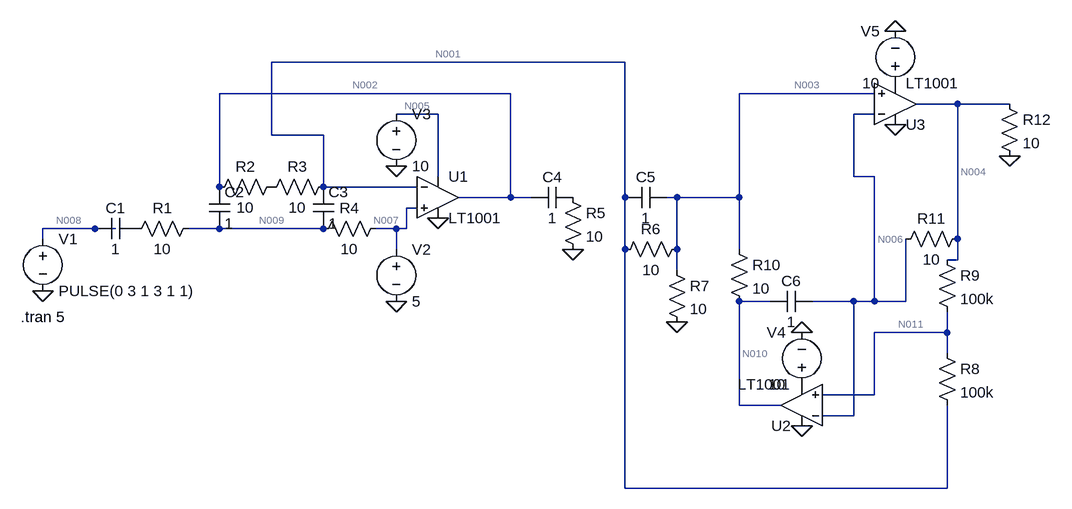
[diagram p0: schematic Draft1.asc]
Draft1.asc, the LTspice schematic file:
Version 4
SHEET 1 880 680
WIRE -336 -240 -880 -240
WIRE -512 -192 -960 -192
WIRE 48 -192 -160 -192
WIRE 176 -176 112 -176
WIRE 256 -176 176 -176
WIRE -624 -160 -688 -160
WIRE 48 -160 16 -160
WIRE -880 -128 -880 -240
WIRE -800 -128 -880 -128
WIRE -624 -64 -624 -160
WIRE 16 -64 16 -160
WIRE 48 -64 16 -64
WIRE -960 -48 -960 -192
WIRE -800 -48 -800 -128
WIRE -656 -48 -800 -48
WIRE -512 -32 -512 -192
WIRE -512 -32 -592 -32
WIRE -480 -32 -512 -32
WIRE -336 -32 -336 -240
WIRE -256 -32 -272 -32
WIRE -160 -32 -160 -192
WIRE -160 -32 -256 -32
WIRE -656 -16 -672 -16
WIRE -1152 16 -1232 16
WIRE -1120 16 -1152 16
WIRE -960 16 -1008 16
WIRE -800 16 -960 16
WIRE -688 16 -720 16
WIRE -672 16 -672 -16
WIRE -672 16 -688 16
WIRE -1232 32 -1232 16
WIRE 176 32 176 -176
WIRE -688 48 -688 16
WIRE -336 48 -336 -32
WIRE -256 48 -256 -32
WIRE -160 48 -160 -32
WIRE 176 64 176 32
WIRE 176 64 160 64
WIRE -256 80 -256 48
WIRE -112 128 -160 128
WIRE 16 128 -48 128
WIRE 48 128 48 -64
WIRE 48 128 16 128
WIRE 96 128 96 32
WIRE 96 128 48 128
WIRE 160 176 160 144
WIRE 160 176 48 176
WIRE 160 208 160 176
WIRE 48 272 48 176
WIRE 48 272 -32 272
WIRE -160 288 -160 128
WIRE -96 288 -160 288
WIRE 16 304 16 128
WIRE 16 304 -32 304
WIRE -336 416 -336 48
WIRE 160 416 160 288
WIRE 160 416 -336 416
FLAG -1232 112 0
FLAG -688 128 0
FLAG -624 0 0
FLAG -688 -80 0
FLAG -416 48 0
FLAG -256 160 0
FLAG -64 320 0
FLAG -64 176 0
FLAG 80 -144 0
FLAG 80 -288 0
FLAG 256 -96 0
SYMBOL voltage -1232 16 R0
WINDOW 123 0 0 Left 2
WINDOW 39 0 0 Left 2
SYMATTR InstName V1
SYMATTR Value PULSE(0 3 1 3 1 1)
SYMBOL cap -1088 0 R90
WINDOW 0 0 32 VBottom 2
WINDOW 3 32 32 VTop 2
SYMATTR InstName C1
SYMATTR Value 1
SYMBOL res -992 0 R90
WINDOW 0 0 56 VBottom 2
WINDOW 3 32 56 VTop 2
SYMATTR InstName R1
SYMATTR Value 10
SYMBOL cap -976 -48 R0
SYMATTR InstName C2
SYMATTR Value 1
SYMBOL res -864 -64 R90
WINDOW 0 0 56 VBottom 2
WINDOW 3 32 56 VTop 2
SYMATTR InstName R2
SYMATTR Value 10
SYMBOL res -784 -64 R90
WINDOW 0 0 56 VBottom 2
WINDOW 3 32 56 VTop 2
SYMATTR InstName R3
SYMATTR Value 10
SYMBOL cap -816 -48 R0
SYMATTR InstName C3
SYMATTR Value 1
SYMBOL res -704 0 R90
WINDOW 0 0 56 VBottom 2
WINDOW 3 32 56 VTop 2
SYMATTR InstName R4
SYMATTR Value 10
SYMBOL voltage -688 32 R0
WINDOW 123 0 0 Left 2
WINDOW 39 0 0 Left 2
SYMATTR InstName V2
SYMATTR Value 5
SYMBOL Opamps\\LT1001 -624 -96 R0
SYMATTR InstName U1
SYMBOL voltage -688 -176 R0
WINDOW 123 0 0 Left 2
WINDOW 39 0 0 Left 2
SYMATTR InstName V3
SYMATTR Value 10
SYMBOL cap -416 -48 R90
WINDOW 0 0 32 VBottom 2
WINDOW 3 32 32 VTop 2
SYMATTR InstName C4
SYMATTR Value 1
SYMBOL res -432 -48 R0
SYMATTR InstName R5
SYMATTR Value 10
SYMBOL cap -272 -48 R90
WINDOW 0 0 32 VBottom 2
WINDOW 3 32 32 VTop 2
SYMATTR InstName C5
SYMATTR Value 1
SYMBOL res -240 32 R90
WINDOW 0 0 56 VBottom 2
WINDOW 3 32 56 VTop 2
SYMATTR InstName R6
SYMATTR Value 10
SYMBOL res -272 64 R0
SYMATTR InstName R7
SYMATTR Value 10
SYMBOL res 144 192 R0
SYMATTR InstName R8
SYMATTR Value 100k
SYMBOL res 144 48 R0
SYMATTR InstName R9
SYMATTR Value 100k
SYMBOL res -176 32 R0
SYMATTR InstName R10
SYMATTR Value 10
SYMBOL cap -48 112 R90
WINDOW 0 0 32 VBottom 2
WINDOW 3 32 32 VTop 2
SYMATTR InstName C6
SYMATTR Value 1
SYMBOL Opamps\\LT1001 -64 352 R180
SYMATTR InstName U2
SYMBOL voltage -64 272 R180
WINDOW 0 24 96 Left 2
WINDOW 3 24 16 Left 2
WINDOW 123 0 0 Left 2
WINDOW 39 0 0 Left 2
SYMATTR InstName V4
SYMATTR Value 10
SYMBOL res 192 16 R90
WINDOW 0 0 56 VBottom 2
WINDOW 3 32 56 VTop 2
SYMATTR InstName R11
SYMATTR Value 10
SYMBOL Opamps\\LT1001 80 -112 M180
SYMATTR InstName U3
SYMBOL voltage 80 -192 R180
WINDOW 0 24 96 Left 2
WINDOW 3 24 16 Left 2
WINDOW 123 0 0 Left 2
WINDOW 39 0 0 Left 2
SYMATTR InstName V5
SYMATTR Value 10
SYMBOL res 240 -192 R0
SYMATTR InstName R12
SYMATTR Value 10
TEXT -1266 152 Left 2 !.tran 5

The netlist it stands for:
* Draft1.asc
V1 N008 0 PULSE(0 3 1 3 1 1)
C1 P001 N008 1
R1 N009 P001 10
C2 N002 N009 1
R2 P002 N002 10
R3 N001 P002 10
C3 N001 N009 1
R4 N007 N009 10
V2 N007 0 5
XU1 N007 N001 N005 0 N002 LT1001  ; pins In+ In- V+ V- OUT
V3 N005 0 10
C4 P003 N002 1
R5 P003 0 10
C5 N003 N001 1
R6 N003 N001 10
R7 N003 0 10
R8 N011 N001 100k
R9 N004 N011 100k
R10 N003 N010 10
C6 N006 N010 1
XU2 N011 N006 0 P004 N010 LT1001  ; pins In+ In- V+ V- OUT
V4 P004 0 10
R11 N004 N006 10
XU3 N003 N006 0 P005 N004 LT1001  ; pins In+ In- V+ V- OUT
V5 P005 0 10
R12 N004 0 10
.tran 5
.lib LTC.lib
.backanno
.end

* Results of the author's LTspice run, read from the files saved beside the schematic
* Operating Point, zero values left out:
*   V(p001) = 5 V
*   V(n009) = 5 V
*   V(n002) = 3.855 V
*   V(p002) = 3.47 V
*   V(n001) = 3.086 V
*   V(n007) = 5 V
*   V(n005) = 10 V
*   V(n003) = 2.698 V
*   V(n011) = 4.044 V
*   V(n004) = 5 V
*   V(n010) = 5 V
*   V(n006) = 4.993 V
*   V(p004) = 10 V
*   V(p005) = 10 V
*   I(C4) = -3.855 pA
*   I(C3) = -1.914 pA
*   I(C2) = -1.145 pA
*   I(C1) = 5 pA
*   I(R12) = 500 mA
*   I(R11) = 691.8 µA
*   I(R10) = -230.2 mA
*   I(R9) = 9.565 µA
*   I(R8) = 9.578 µA
*   I(R7) = 269.8 mA
*   I(R6) = -38.82 mA
*   I(R5) = 3.855 pA
*   I(R4) = 8.06 pA
*   I(R3) = -38.45 mA
*   I(R2) = -38.45 mA
*   I(R1) = 5 pA
*   I(V5) = -3.572 TA
*   I(V4) = -3.572 TA
*   I(V3) = -38.44 mA
*   I(V2) = -363.4 µA
*   I(V1) = 5 pA
*   Ix(u1:1) = 363.4 µA
*   Ix(u1:2) = -363.4 µA
*   Ix(u1:3) = 38.44 mA
*   Ix(u1:4) = -490.6 pA
*   Ix(u1:5) = -38.45 mA
*   Ix(u2:1) = -12.82 nA
*   Ix(u2:2) = 12.82 nA
*   Ix(u2:3) = -3.572 TA
*   Ix(u2:4) = 3.572 TA
*   Ix(u2:5) = -228.5 mA
*   Ix(u3:1) = -691.8 µA
*   Ix(u3:2) = 691.8 µA
*   Ix(u3:3) = -3.572 TA
*   Ix(u3:4) = 3.572 TA
*   Ix(u3:5) = -502 mA
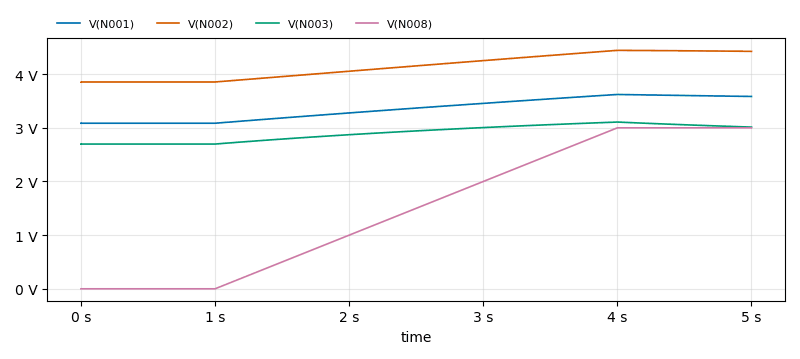
[diagram p1: Transient Analysis of Draft1.asc, plotted from the saved traces]
* Transient Analysis, 1 run:
*   V(N001): min 3.086 V, max 3.622 V, average 3.356 V, rms 3.362 V, last 3.585 V
*   V(N002): min 3.855 V, max 4.444 V, average 4.15 V, rms 4.156 V, last 4.426 V
*   V(N003): min 2.698 V, max 3.108 V, average 2.909 V, rms 2.913 V, last 3.014 V
*   V(N008): min 0 V, max 3 V, average 1.5 V, rms 1.898 V, last 3 V